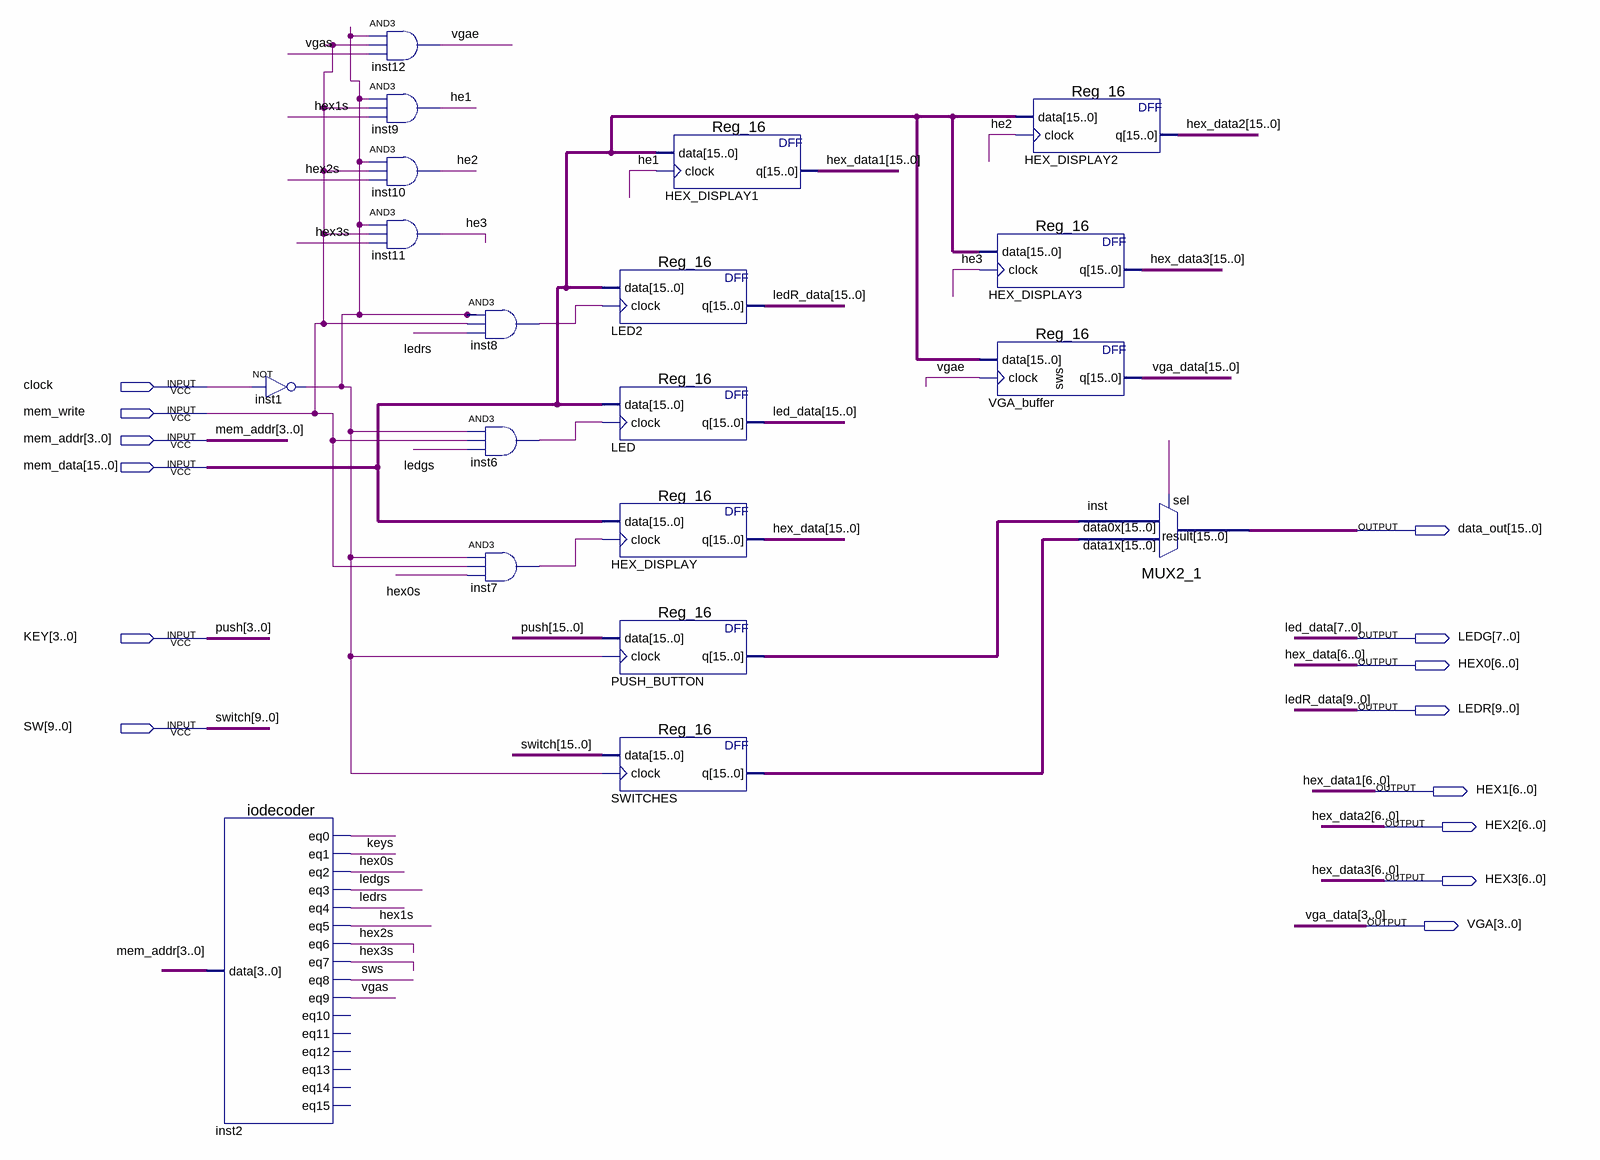
[diagram p0: schematic sheet]
// Quartus schematic IO_MemoryInterface.bdf as structural Verilog: 19 symbols, 14 pins
module IO_MemoryInterface (
  input  clock,
  input  mem_write,
  input  [3:0] mem_addr,
  input  [15:0] mem_data,
  input  [3:0] KEY,
  input  [9:0] SW,
  output [15:0] data_out,
  output [7:0] LEDG,
  output [6:0] HEX0,
  output [9:0] LEDR,
  output [6:0] HEX1,
  output [6:0] HEX2,
  output [6:0] HEX3,
  output [3:0] VGA
);

  wire he1, he2, he3, hex0s, hex1s, hex2s, hex3s, inst1_out, inst2_eq0, inst6_out, inst7_out, inst8_out,
       keys, ledgs, ledrs, sws, vgae, vgas;
  wire [15:0] PUSH_BUTTON_q, SWITCHES_q;
  wire [15:4] push, vga_data;
  wire [15:7] hex_data, hex_data1, hex_data2, hex_data3;
  wire [15:8] led_data;
  wire [15:10] ledR_data, switch;

  iodecoder inst2 (
    .data(mem_addr), .eq0(inst2_eq0), .eq1(keys), .eq2(hex0s), .eq3(ledgs), .eq4(ledrs), .eq5(hex1s),
    .eq6(hex2s), .eq7(hex3s), .eq8(sws), .eq9(vgas));  // open: eq10, eq11, eq12, eq13, eq14, eq15
  not inst1 (inst1_out, clock);
  and inst12 (vgae, inst1_out, mem_write, vgas);
  and inst9 (he1, inst1_out, mem_write, hex1s);
  and inst10 (he2, inst1_out, mem_write, hex2s);
  and inst11 (he3, inst1_out, mem_write, hex3s);
  and inst8 (inst8_out, inst1_out, mem_write, ledrs);
  and inst6 (inst6_out, inst1_out, mem_write, ledgs);
  and inst7 (inst7_out, inst1_out, mem_write, hex0s);
  Reg_16 LED2 (.data(mem_data), .clock(inst8_out), .q({ledR_data, LEDR}));
  Reg_16 LED (.data(mem_data), .clock(inst6_out), .q({led_data, LEDG}));
  Reg_16 HEX_DISPLAY (.data(mem_data), .clock(inst7_out), .q({hex_data, HEX0}));
  Reg_16 PUSH_BUTTON (.data({push, KEY}), .clock(inst1_out), .q(PUSH_BUTTON_q));
  Reg_16 SWITCHES (.data({switch, SW}), .clock(inst1_out), .q(SWITCHES_q));
  Reg_16 HEX_DISPLAY1 (.data(mem_data), .clock(he1), .q({hex_data1, HEX1}));
  Reg_16 HEX_DISPLAY2 (.data(mem_data), .clock(he2), .q({hex_data2, HEX2}));
  Reg_16 HEX_DISPLAY3 (.data(mem_data), .clock(he3), .q({hex_data3, HEX3}));
  Reg_16 VGA_buffer (.data(mem_data), .clock(vgae), .q({vga_data, VGA}));
  MUX2_1 inst (.data1x(SWITCHES_q), .data0x(PUSH_BUTTON_q), .sel(sws), .result(data_out));

  // Other names for the same wires on the sheet: hex_data[6:0] = HEX0; hex_data1[6:0] = HEX1; hex_data2[6:0] = HEX2;
  //   hex_data3[6:0] = HEX3; led_data[7:0] = LEDG; ledR_data[9:0] = LEDR; push[3:0] = KEY; switch[9:0] = SW;
  //   vga_data[3:0] = VGA
endmodule
